# EAGLE design General IO (EAGLE 4.13)
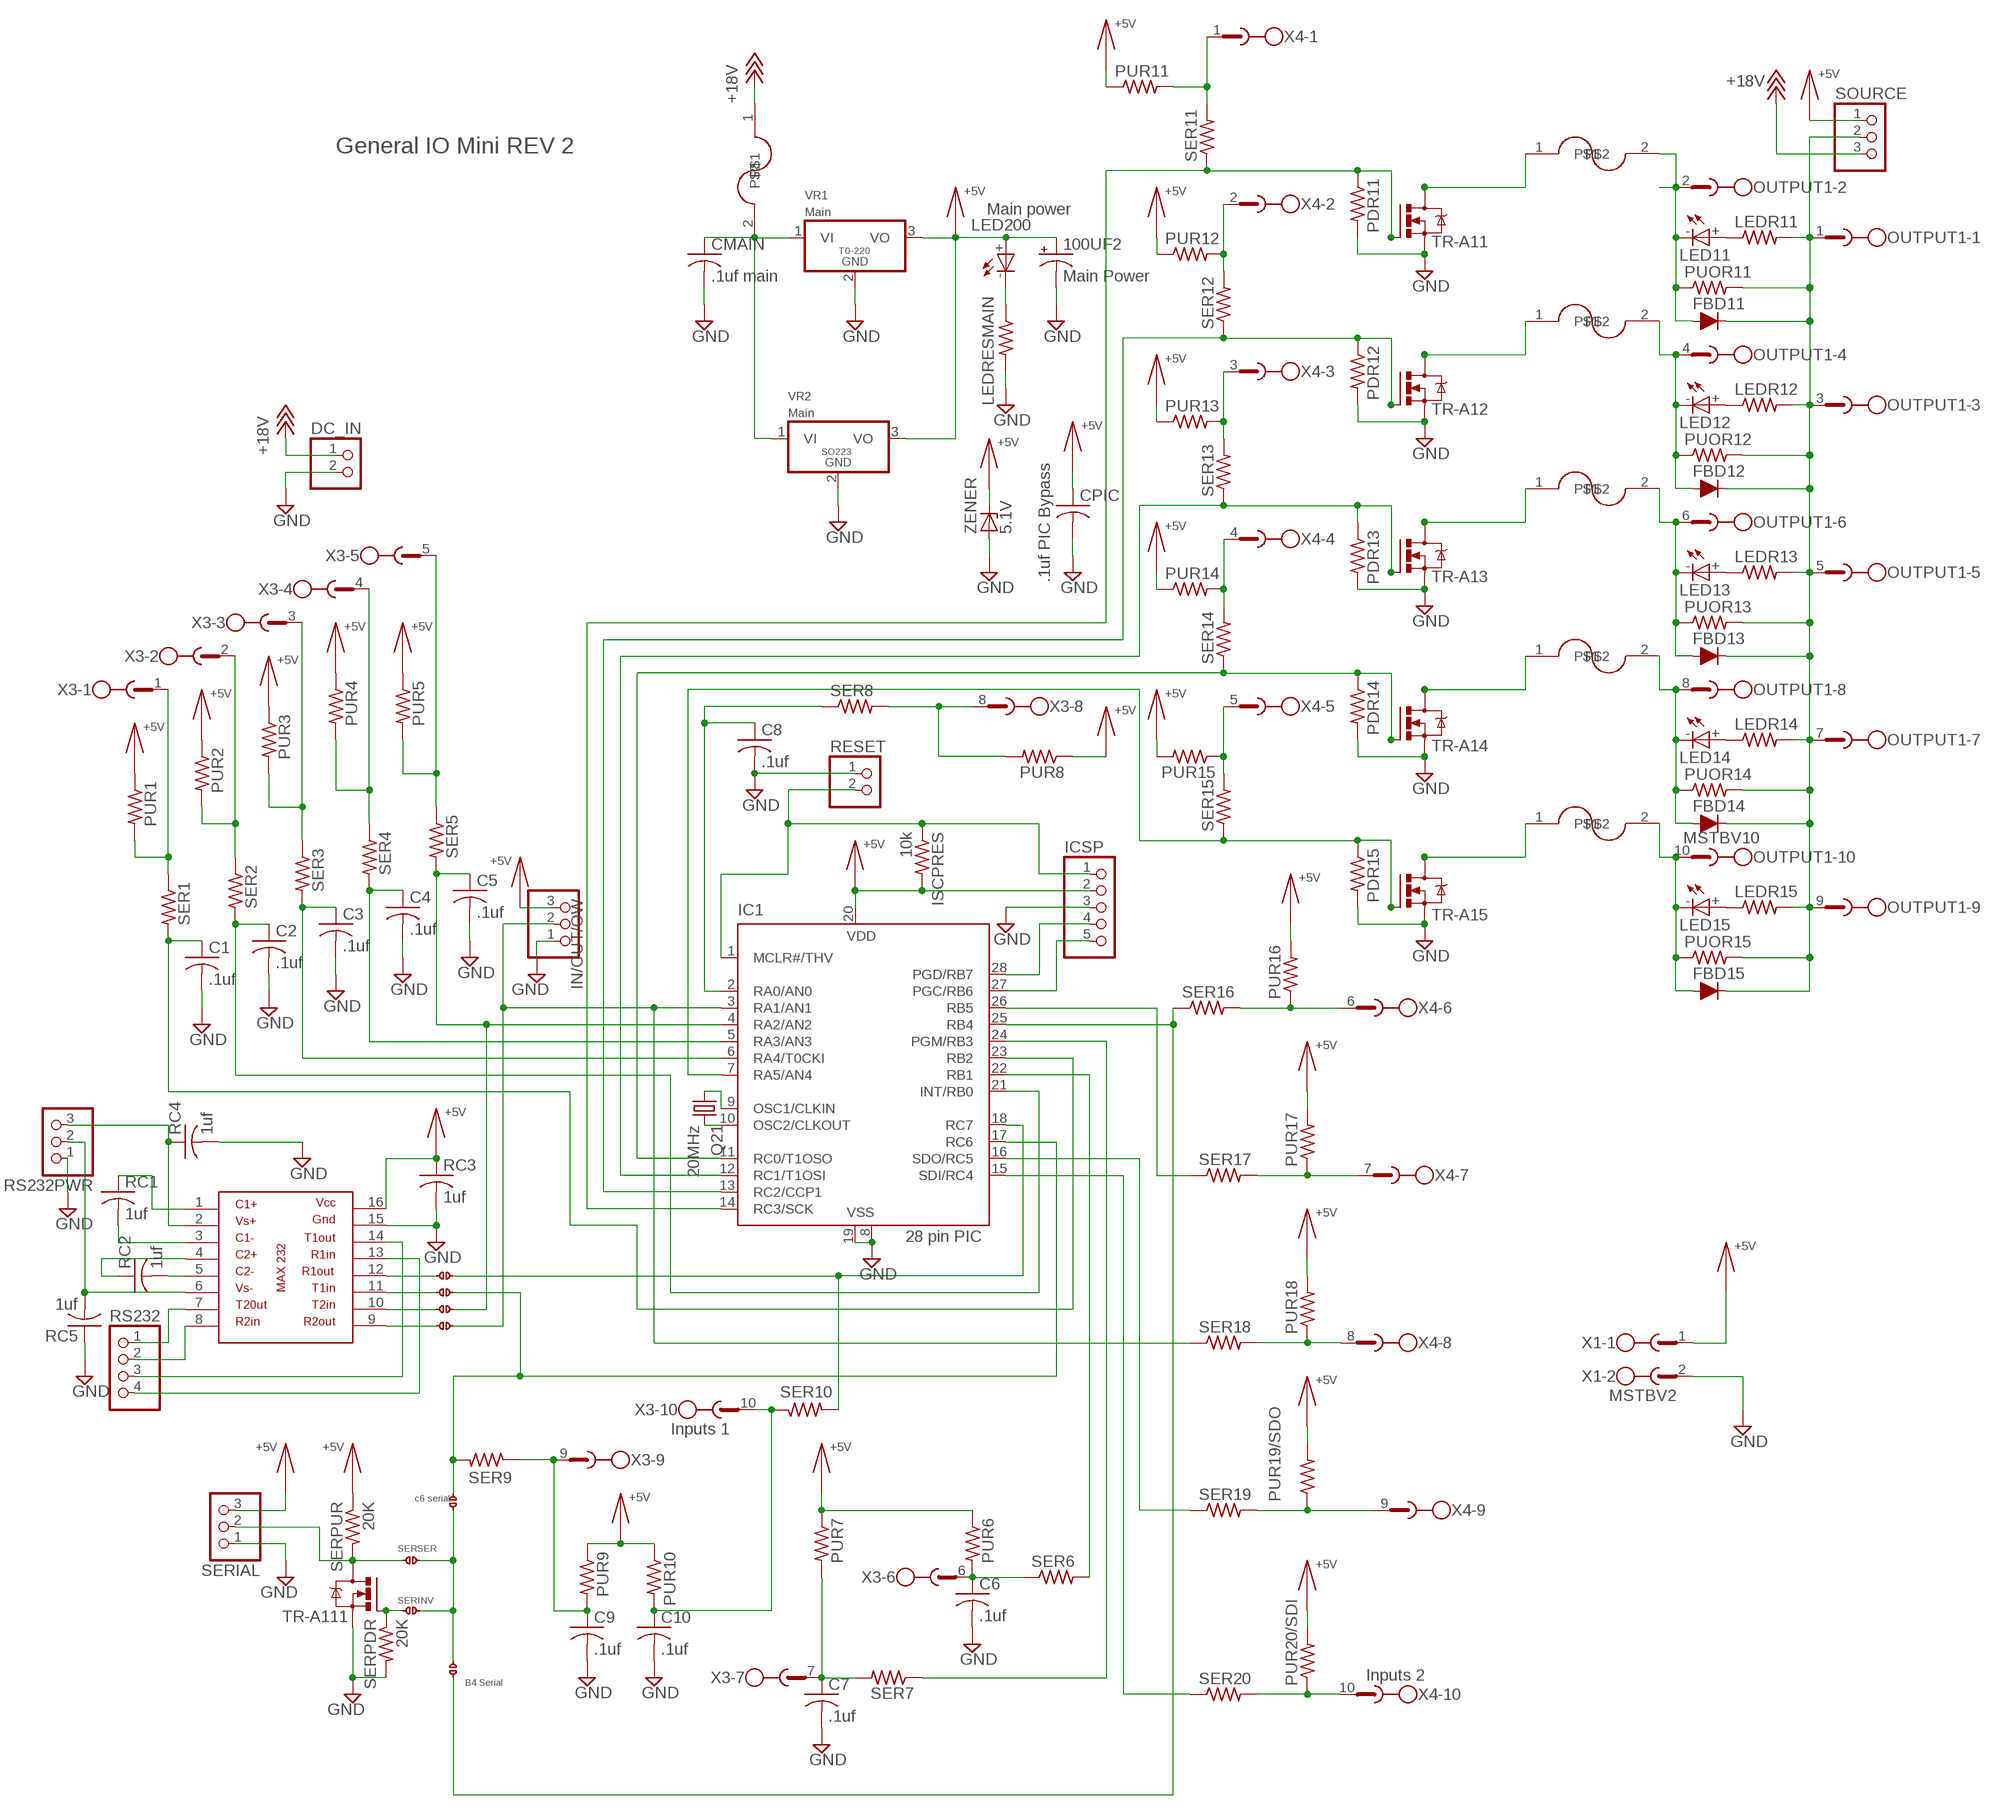
[diagram p0: schematic, sheet 1]

## Parts
100UF2  Main Power  CAPACITOR-ELECTROLYTICG  [PANASONIC_G]
B4SERIAL  SPLIT_PAD  [SPLIT_PAD]
C1  .1uf  CAPACITOR-NO-POLARITYC1210  [C1210]
C2  .1uf  CAPACITOR-NO-POLARITYC1210  [C1210]
C3  .1uf  CAPACITOR-NO-POLARITYC1210  [C1210]
C4  .1uf  CAPACITOR-NO-POLARITYC1210  [C1210]
C5  .1uf  CAPACITOR-NO-POLARITYC1210  [C1210]
C6  .1uf  CAPACITOR-NO-POLARITYC1210  [C1210]
C6SERIAL  SPLIT_PAD  [SPLIT_PAD]
C7  .1uf  CAPACITOR-NO-POLARITYC1210  [C1210]
C8  .1uf  CAPACITOR-NO-POLARITYC1210  [C1210]
C9  .1uf  CAPACITOR-NO-POLARITYC1210  [C1210]
C10  .1uf  CAPACITOR-NO-POLARITYC1210  [C1210]
CMAIN  .1uf main  CAPACITOR-NO-POLARITYC1210  [C1210]
CPIC  .1uf PIC Bypass  CAPACITOR-NO-POLARITYC1210  [C1210]
DC_IN  PINHD-1X2  [1X02]
FBD11  D-FILL-SOD-87  [SOD87]
FBD12  D-FILL-SOD-87  [SOD87]
FBD13  D-FILL-SOD-87  [SOD87]
FBD14  D-FILL-SOD-87  [SOD87]
FBD15  D-FILL-SOD-87  [SOD87]
IC1  28 pin PIC  PIC16F876SO  [SO-28W]
ICSP  PINHD-1X5  [1X05]
IN/OUT/OW  PINHD-1X3  [1X03]
ISCPRES  10k  RESISITORM1406  [M1406]
LED11  LED  [1206]
LED12  LED  [1206]
LED13  LED  [1206]
LED14  LED  [1206]
LED15  LED  [1206]
LED200  Main power  LED  [1206]
LEDR11  RESISITORM1406  [M1406]
LEDR12  RESISITORM1406  [M1406]
LEDR13  RESISITORM1406  [M1406]
LEDR14  RESISITORM1406  [M1406]
LEDR15  RESISITORM1406  [M1406]
LEDRESMAIN  RESISITORR1210  [R1210]
OUTPUT1  MSTBV10  [MSTBV10]
PDR11  RESISITORM1406  [M1406]
PDR12  RESISITORM1406  [M1406]
PDR13  RESISITORM1406  [M1406]
PDR14  RESISITORM1406  [M1406]
PDR15  RESISITORM1406  [M1406]
POLYFUSE11  POLYFUSE  [0204/5]
POLYFUSE12  POLYFUSE  [0204/5]
POLYFUSE13  POLYFUSE  [0204/5]
POLYFUSE14  POLYFUSE  [0204/5]
POLYFUSE15  POLYFUSE  [0204/5]
POLYFUSE200  Main power  POLYFUSE  [0204/5]
PUOR11  RESISITORM1406  [M1406]
PUOR12  RESISITORM1406  [M1406]
PUOR13  RESISITORM1406  [M1406]
PUOR14  RESISITORM1406  [M1406]
PUOR15  RESISITORM1406  [M1406]
PUR1  RESISITORM1406  [M1406]
PUR2  RESISITORM1406  [M1406]
PUR3  RESISITORM1406  [M1406]
PUR4  RESISITORM1406  [M1406]
PUR5  RESISITORM1406  [M1406]
PUR6  RESISITORM1406  [M1406]
PUR7  RESISITORM1406  [M1406]
PUR8  RESISITORM1406  [M1406]
PUR9  RESISITORM1406  [M1406]
PUR10  RESISITORM1406  [M1406]
PUR11  RESISITORM1406  [M1406]
PUR12  RESISITORM1406  [M1406]
PUR13  RESISITORM1406  [M1406]
PUR14  RESISITORM1406  [M1406]
PUR15  RESISITORM1406  [M1406]
PUR16  RESISITORM1406  [M1406]
PUR17  RESISITORM1406  [M1406]
PUR18  RESISITORM1406  [M1406]
PUR19/SDO  RESISITORM1406  [M1406]
PUR20/SDI  RESISITORM1406  [M1406]
Q21  20MHz  CRYSTALSM49  [SM49]
R1OUT  SPLIT_PAD  [SPLIT_PAD]
RC1  1uf  CAPACITOR-NO-POLARITYC1210  [C1210]
RC2  1uf  CAPACITOR-NO-POLARITYC1210  [C1210]
RC3  1uf  CAPACITOR-NO-POLARITYC1210  [C1210]
RC4  1uf  CAPACITOR-NO-POLARITYC1210  [C1210]
RC5  1uf  CAPACITOR-NO-POLARITYC1210  [C1210]
RESET  PINHD-1X2  [1X02]
RS232  PINHD-1X4  [1X04]
RS232PWR  PINHD-1X3  [1X03]
SER1  RESISITORM1406  [M1406]
SER2  RESISITORM1406  [M1406]
SER3  RESISITORM1406  [M1406]
SER4  RESISITORM1406  [M1406]
SER5  RESISITORM1406  [M1406]
SER6  RESISITORM1406  [M1406]
SER7  RESISITORM1406  [M1406]
SER8  RESISITORM1406  [M1406]
SER9  RESISITORM1406  [M1406]
SER10  RESISITORM1406  [M1406]
SER11  RESISITORM1406  [M1406]
SER12  RESISITORM1406  [M1406]
SER13  RESISITORM1406  [M1406]
SER14  RESISITORM1406  [M1406]
SER15  RESISITORM1406  [M1406]
SER16  RESISITORM1406  [M1406]
SER17  RESISITORM1406  [M1406]
SER18  RESISITORM1406  [M1406]
SER19  RESISITORM1406  [M1406]
SER20  RESISITORM1406  [M1406]
SERIAL  PINHD-1X3  [1X03]
SERIAL_INVERT  SPLIT_PAD  [SPLIT_PAD]
SERPDR  20K  RESISITORM1406  [M1406]
SERPUR  20K  RESISITORM1406  [M1406]
SERSER  SPLIT_PAD  [SPLIT_PAD]
SOURCE  PINHD-1X3  [1X03]
T1IN  SPLIT_PAD  [SPLIT_PAD]
T1IN1  SPLIT_PAD  [SPLIT_PAD]
T1IN2  SPLIT_PAD  [SPLIT_PAD]
TR-A11  ZXMN10A08GSOT223  [SOT223R_INFINEON]
TR-A12  ZXMN10A08GSOT223  [SOT223R_INFINEON]
TR-A13  ZXMN10A08GSOT223  [SOT223R_INFINEON]
TR-A14  ZXMN10A08GSOT223  [SOT223R_INFINEON]
TR-A15  ZXMN10A08GSOT223  [SOT223R_INFINEON]
TR-A111  ZXMN10A08GSOT223  [SOT223R_INFINEON]
U$1  MAX232  [SO16]
VR1  Main  VOLTAGE-REGULATOR  [TO220S]
VR2  Main  VOLTAGE-REGULATORSO-223  [SOT223R_INFINEON]
X1  MSTBV2  [MSTBV2]
X3  Inputs 1  MSTBV10  [MSTBV10]
X4  Inputs 2  MSTBV10  [MSTBV10]
ZENER  5.1V  ZENER-DIODESMB  [SMB]

## Nets
$N199: IC1.15(SDI/RC4) SER20.1
+5V: 100UF2.+ CPIC.1 IC1.20(VDD) ICSP.2 IN/OUT/OW.3 ISCPRES.2 LED200.+ PUR1.1 PUR2.1 PUR3.1 PUR4.1 PUR5.1 PUR6.1 PUR7.1 PUR8.1 PUR9.1 PUR10.1 PUR11.1 PUR12.1 PUR13.1 PUR14.1 PUR15.2 PUR16.2 PUR17.2 PUR18.2 PUR19/SDO.2 PUR20/SDI.2 RC3.1 SERIAL.3 SERPUR.1 SOURCE.1 U$1.16 VR1.3(VO) VR2.3(VO) X1.1 ZENER.C
+18V: DC_IN.1 POLYFUSE200.1 SOURCE.3
GND: 100UF2.- C1.2 C2.2 C3.2 C4.2 C5.2 C6.2 C7.2 C8.2 C9.2 C10.2 CMAIN.2 CPIC.2 DC_IN.2 IC1.8(VSS) IC1.19(VSS) ICSP.3 IN/OUT/OW.1 LEDRESMAIN.2 PDR11.2 PDR12.2 PDR13.2 PDR14.2 PDR15.2 RC3.2 RC4.2 RC5.1 RESET.1 RS232PWR.1 SERIAL.1 SERPDR.2 TR-A11.3(S) TR-A12.3(S) TR-A13.3(S) TR-A14.3(S) TR-A15.3(S) TR-A111.3(S) U$1.15 VR1.2(GND) VR2.2(GND) X1.2 ZENER.A
N$1: PUR20/SDI.1 SER20.2 X4.10
N$2: T1IN.P$2 U$1.11
N$3: PUR17.1 SER17.2 X4.7
N$4: R1OUT.P$2 U$1.12
N$5: T1IN1.P$2 U$1.10
N$6: T1IN2.P$2 U$1.9
N$7: C1.1 IC1.23(RB2) SER1.2
N$8: IC1.26(RB5) SER17.1
N$9: C2.1 IC1.21(INT/RB0) SER2.2
N$10: C3.1 IC1.6(RA4/T0CKI) SER3.2
N$11: IC1.16(SDO/RC5) SER19.1
N$12: C8.1 IC1.2(RA0/AN0) SER8.1
N$13: IC1.13(RC2/CCP1) PDR12.1 SER12.1 TR-A12.1(G)
N$14: IC1.12(RC1/T1OSI) PDR13.1 SER13.1 TR-A13.1(G)
N$15: IC1.11(RC0/T1OSO) PDR14.1 SER14.1 TR-A14.1(G)
N$16: FBD12.2(A) LED12.- OUTPUT1.4 POLYFUSE12.2 PUOR12.1
N$17: POLYFUSE15.1 TR-A15.2(D)
N$18: FBD15.2(A) LED15.- OUTPUT1.10 POLYFUSE15.2 PUOR15.1
N$19: RS232.1 U$1.7
N$20: PUR16.1 SER16.2 X4.6
N$21: POLYFUSE14.1 TR-A14.2(D)
N$22: FBD14.2(A) LED14.- OUTPUT1.8 POLYFUSE14.2 PUOR14.1
N$23: POLYFUSE13.1 TR-A13.2(D)
N$24: FBD13.2(A) LED13.- OUTPUT1.6 POLYFUSE13.2 PUOR13.1
N$25: PUR14.2 SER14.2 X4.4
N$26: PUR12.2 SER12.2 X4.2
N$27: POLYFUSE12.1 TR-A12.2(D)
N$28: PUR13.2 SER13.2 X4.3
N$29: POLYFUSE11.1 TR-A11.2(D)
N$30: FBD11.2(A) LED11.- OUTPUT1.2 POLYFUSE11.2 PUOR11.1
N$31: IC1.28(PGD/RB7) ICSP.4
N$32: PUR15.1 SER15.2 X4.5
N$33: IC1.7(RA5/AN4) PDR15.1 SER15.1 TR-A15.1(G)
N$35: IC1.10(OSC2/CLKOUT) Q21.2
N$36: SERIAL_INVERT.P$2 SERPDR.1 TR-A111.1(G)
N$37: IC1.1(MCLR#/THV) ICSP.1 ISCPRES.1 RESET.2
N$38: SERIAL.2 SERPUR.2 SERSER.P$2 TR-A111.2(D)
N$39: IC1.9(OSC1/CLKIN) Q21.1
N$40: IC1.27(PGC/RB6) ICSP.5
N$41: IC1.18(RC7) R1OUT.P$1 SER10.2
N$42: C9.1 PUR9.2 SER9.1 X3.9
N$43: C5.1 IC1.4(RA2/AN2) SER5.2 T1IN1.P$1
N$44: C6SERIAL.P$1 IC1.17(RC6) SER9.2 T1IN.P$1
N$45: RS232.2 U$1.8
N$49: RS232.3 U$1.14
N$52: FBD11.1(C) FBD12.1(C) FBD13.1(C) FBD14.1(C) FBD15.1(C) LEDR11.2 LEDR12.2 LEDR13.2 LEDR14.2 LEDR15.2 OUTPUT1.1 OUTPUT1.3 OUTPUT1.5 OUTPUT1.7 OUTPUT1.9 PUOR11.2 PUOR12.2 PUOR13.2 PUOR14.2 PUOR15.2 SOURCE.2
N$55: LED200.- LEDRESMAIN.1
N$60: RS232.4 U$1.13
N$63: CMAIN.1 POLYFUSE200.2 VR1.1(VI) VR2.1(VI)
N$71: LED15.+ LEDR15.1
N$72: LED14.+ LEDR14.1
N$73: LED13.+ LEDR13.1
N$74: LED12.+ LEDR12.1
N$75: LED11.+ LEDR11.1
N$77: PUR3.2 SER3.1 X3.3
N$80: RC2.2 U$1.5
N$81: RC1.2 U$1.3
N$82: RC2.1 U$1.4
N$83: RC1.1 U$1.1
N$84: RC4.1 RS232PWR.3 U$1.2
N$85: RC5.2 RS232PWR.2 U$1.6
N$86: PUR4.2 SER4.1 X3.4
N$87: PUR5.2 SER5.1 X3.5
N$88: PUR8.2 SER8.2 X3.8
N$89: PUR1.2 SER1.1 X3.1
N$90: IC1.14(RC3/SCK) PDR11.1 SER11.1 TR-A11.1(G)
N$91: PUR2.2 SER2.1 X3.2
N$92: PUR11.2 SER11.2 X4.1
N$95: C4.1 IC1.5(RA3/AN3) SER4.2
N$99: B4SERIAL.P$2 IC1.25(RB4) SER16.1
N$100: PUR19/SDO.1 SER19.2 X4.9
N$102: PUR18.1 SER18.2 X4.8
N$104: B4SERIAL.P$1 C6SERIAL.P$2 SERIAL_INVERT.P$1 SERSER.P$1
N$106: C6.1 PUR6.2 SER6.1 X3.6
N$107: IC1.22(RB1) SER6.2
N$108: C7.1 PUR7.2 SER7.2 X3.7
N$109: C10.1 PUR10.2 SER10.1 X3.10
N$111: IC1.24(PGM/RB3) SER7.1
SER18: IC1.3(RA1/AN1) IN/OUT/OW.2 SER18.1 T1IN2.P$1

## Notes on the sheet
- General IO Mini REV 2
- T0-220
- SO223
- c6 serial
- SERSER
- SERINV
- B4 Serial

## Library data of the parts
100UF2 = 1 Dan's Common Parts:CAPACITOR-ELECTROLYTIC: POLARIZED CAPACITOR, American symbol
B4SERIAL C6SERIAL R1OUT SERIAL_INVERT SERSER T1IN T1IN1 T1IN2 = 1 Dan's Common Parts:SPLIT_PAD
C1-C10 CMAIN CPIC RC1-RC5 = 1 Dan's Common Parts:CAPACITOR-NO-POLARITY: CAPACITOR, American symbol
DC_IN RESET = pinhead:PINHD-1X2: PIN HEADER
FBD11-FBD15 = semicon-smd-ipc:D-FILL-: DIODE filled
IC1 = 1 Dan's Common Parts:PIC16*876: MICROCONTROLLER flash type
ICSP = pinhead:PINHD-1X5: PIN HEADER
IN/OUT/OW RS232PWR SERIAL SOURCE = pinhead:PINHD-1X3: PIN HEADER
ISCPRES LEDR11-LEDR15 LEDRESMAIN PDR11-PDR15 PUOR11-PUOR15 PUR1-PUR18 PUR19/SDO PUR20/SDI SER1-SER20 SERPDR SERPUR = 1 Dan's Common Parts:RESISITOR: RESISTOR, American symbol
LED11-LED15 LED200 = 1 Dan's Common Parts:LED
OUTPUT1 X3 X4 = con-phoenix-508:MSTBV10: PHOENIX
POLYFUSE11-POLYFUSE15 POLYFUSE200 = 1 Dan's Common Parts:POLYFUSE
Q21 = 1 Dan's Common Parts:CRYSTAL: CRYSTAL
RS232 = pinhead:PINHD-1X4: PIN HEADER
TR-A11-TR-A15 TR-A111 = 1 Dan's Common Parts:ZXMN10A08G: N-CHANNEL MOS FET
U$1 = 1 Dan's Common Parts:MAX232
VR1 VR2 = 1 Dan's Common Parts:VOLTAGE-REGULATOR: Positive VOLTAGE REGULATOR Source: http://cache.national.com/ds/LM/LM78L05.pdf http://www.fairchildsemi.com/ds/LM/LM7805.pdf
X1 = con-phoenix-508:MSTBV2: PHOENIX
ZENER = 1 Dan's Common Parts:ZENER-DIODE: Z-Diode

## Board
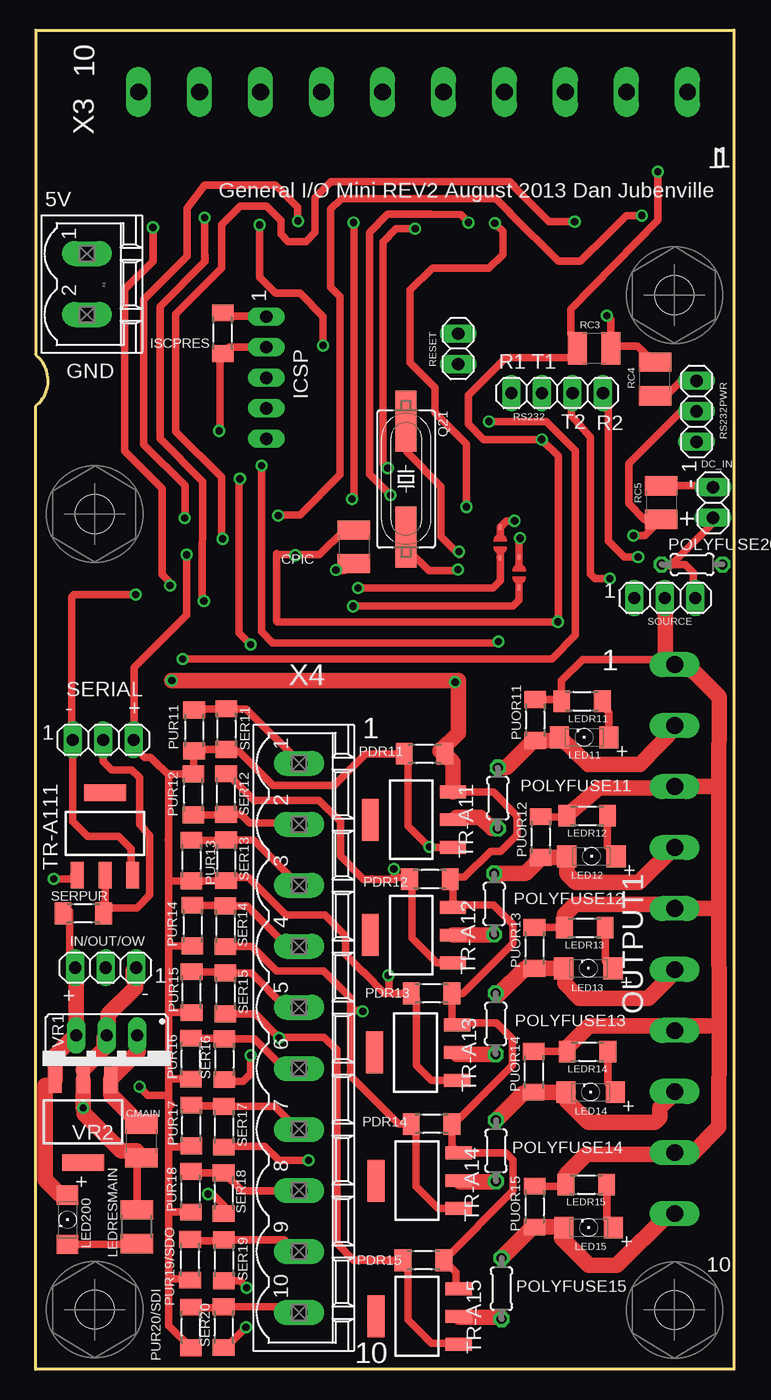
[diagram p1: board, top side]
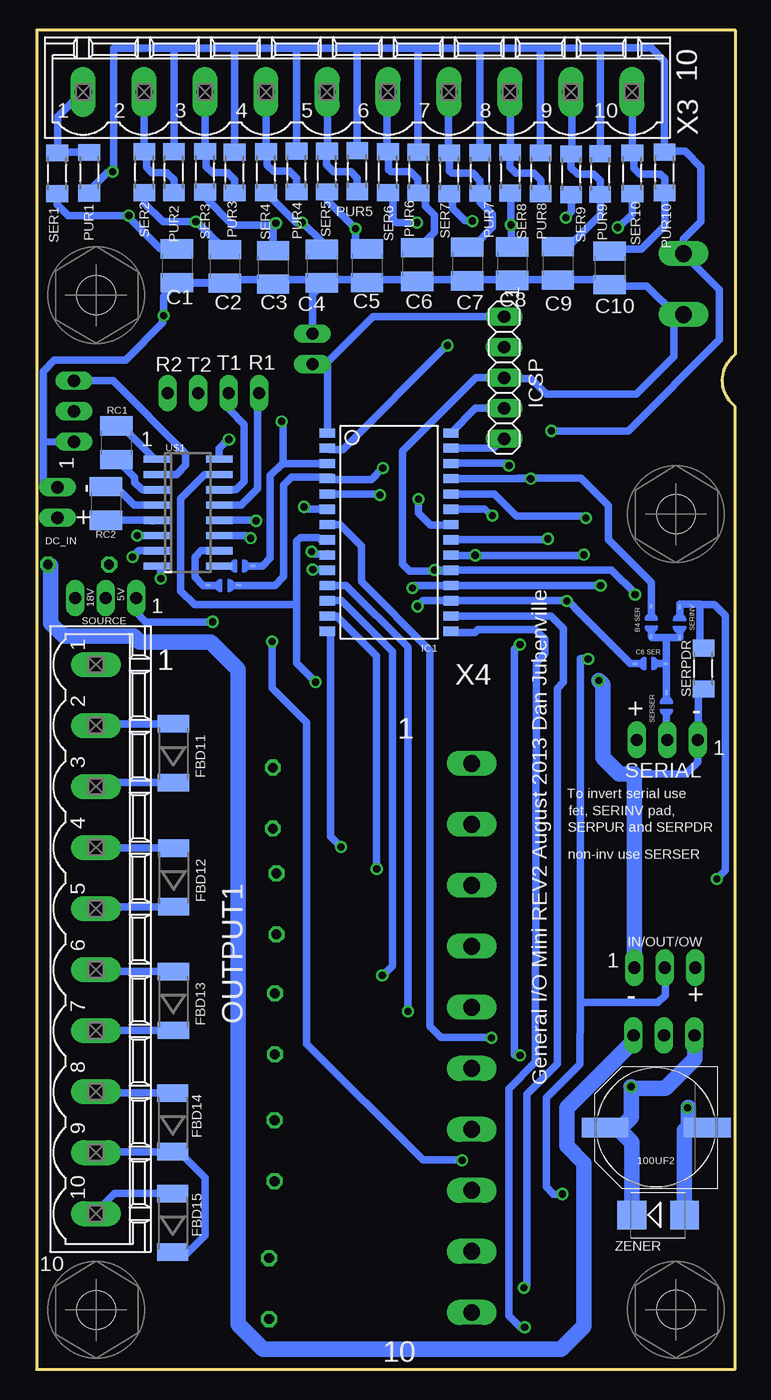
[diagram p2: board, bottom side, seen from below]

Size 58.17 x 111.53 mm. Coordinates in mm from the lower left corner, seen from the top.
Outline: 0.1,80.29 arc100 0.08,84.43
Outline: 0,84.51 0,111.53 58.17,111.53 58.17,0 0,0 0,80.19
Copper layers (1*16): Top 0.035mm / dielectric 1.5mm / Bottom 0.035mm
Design rules "default": minimum track width 5mil, minimum drill 20mil, track to track 15mil, track to pad 15mil, pad to pad 15mil, via to via 15mil, smd to smd 0mil, copper to edge 5mil, drill to drill 5mil, minimum pad ring 10mil, minimum via ring 8mil, stop-mask expansion 4mil, vias tented up to drill 0mil, thermal gap 10mil

### Footprints (pad centres in the part's own frame; a part is rotated, then mirrored left to right if it is on the bottom)
PANASONIC_G = smd 3.9 x 1.6: + 4.25,0; - -4.25,0
SPLIT_PAD = smd 0.406 x 0.203: P$1 0,0; P$2 2.54,0
C1210 = smd 1.6 x 2.7: 1 -1.4,0; 2 1.4,0
1X02 = drill 1.016 long: 1 -1.27,0; 2 1.27,0
SOD87 = smd 1.45 x 2.6: 1 -2.445,0; 2 2.445,0
SO-28W = smd 0.762 x 1.27: 1 -7.62,-5.207; 2 -6.35,-5.207; 3 -5.08,-5.207; 4 -3.81,-5.207; 5 -2.54,-5.207; 6 -1.27,-5.207; 7 0,-5.207; 8 1.27,-5.207; 9 2.54,-5.207; 10 3.81,-5.207; 11 5.08,-5.207; 12 6.35,-5.207; 13 7.62,-5.207; 14 8.89,-5.207; 15 8.89,5.08; 16 7.62,5.08; 17 6.35,5.08; 18 5.08,5.08; 19 3.81,5.08; 20 2.54,5.08; 21 1.27,5.08; 22 0,5.08; 23 -1.27,5.08; 24 -2.54,5.08; 25 -3.81,5.08; 26 -5.08,5.08; 27 -6.35,5.08; 28 -7.62,5.08
1X05 = drill 1.016 long: 1 -5.08,0; 2 -2.54,0; 3 0,0; 4 2.54,0; 5 5.08,0
1X03 = drill 1.016 long: 1 -2.54,0; 2 0,0; 3 2.54,0
M1406 = smd 1.4 x 1.8: 1 -1.7,0; 2 1.7,0
1206 = smd 1.6 x 1.803: + -1.422,0; - 2.692,0
R1210 = smd 1.6 x 2.7: 1 -1.4,0; 2 1.4,0
MSTBV10 = drill 1.397 long: 1 -22.86,0; 2 -17.78,0; 3 -12.7,0; 4 -7.62,0; 5 -2.54,0; 6 2.54,0; 7 7.62,0; 8 12.7,0; 9 17.78,0; 10 22.86,0
0204/5 = drill 0.813 octagon: 1 -2.54,0; 2 2.54,0
SM49 = smd 5.08 x 1.778: 1 -4.826,0; 2 4.826,0
1X04 = drill 1.016 long: 1 -3.81,0; 2 -1.27,0; 3 1.27,0; 4 3.81,0
SOT223R_INFINEON = smd 1.067 x 2.184: 1 -2.311,-3.479; 2 0,-3.48; 3 2.312,-3.48 | smd 3.5 x 1.4: 4 0,3.404
SO16 = smd 0.6 x 2.2: 1 -4.445,-2.6; 2 -3.175,-2.6; 3 -1.905,-2.6; 4 -0.635,-2.6; 5 0.635,-2.6; 6 1.905,-2.6; 7 3.175,-2.6; 8 4.445,-2.6; 9 4.445,2.6; 10 3.175,2.6; 11 1.905,2.6; 12 0.635,2.6; 13 -0.635,2.6; 14 -1.905,2.6; 15 -3.175,2.6; 16 -4.445,2.6
SCREW = hole 3.2: 0,0
TO220S = drill 1.016 long: 1 -2.54,-2.54; 2 0,-2.54; 3 2.54,-2.54
MSTBV2 = drill 1.397 long: 1 -2.54,0; 2 2.54,0
SMB = smd 2.4 x 2.4: A 2.2,0; C -2.2,0

### Placement (x,y rotation side)
100UF2  6.58,20.14 180 bottom
B4SERIAL  6.99,61.01 90 bottom
C1  46.48,91.9 270 bottom
C2  42.49,91.85 270 bottom
C3  38.48,91.77 270 bottom
C4  34.42,91.87 270 bottom
C5  30.66,91.9 270 bottom
C6  26.47,92 270 bottom
C6SERIAL  8.33,58.78 0 bottom
C7  22.3,92.05 270 bottom
C8  18.57,92.08 270 bottom
C9  14.76,92.1 270 bottom
C10  10.44,91.72 270 bottom
CMAIN  8.81,19.02 270 top
CPIC  26.52,68.5 270 top
DC_IN  56.44,72.19 90 top
FBD11  46.79,51.31 90 bottom
FBD12  46.76,40.97 90 bottom
FBD13  46.79,30.68 90 bottom
FBD14  46.84,20.57 90 bottom
FBD15  46.84,12.22 90 bottom
IC1  28.75,70.36 270 bottom
ICSP  19.23,82.58 270 bottom
IN/OUT/OW  5.84,33.45 180 top
ISCPRES  15.6,86.28 270 top
LED11  46.33,52.63 180 top
LED12  46.94,42.72 180 top
LED13  46.69,33.4 180 top
LED14  46.86,23.09 180 top
LED15  46.71,11.81 180 top
LED200  2.67,13.11 270 top
LEDR11  45.52,55.65 180 top
LEDR12  45.95,46.1 180 top
LEDR13  45.75,36.78 180 top
LEDR14  45.97,26.47 180 top
LEDR15  45.87,15.39 180 top
LEDRESMAIN  8.46,11.89 90 top
OUTPUT1  53.24,35.84 270 bottom
PDR11  32.41,51.26 0 top
PDR12  32.84,40.82 0 top
PDR13  32.99,31.32 0 top
PDR14  32.99,20.45 0 top
PDR15  32.31,9.09 0 top
POLYFUSE11  38.51,47.57 90 top
POLYFUSE12  38.2,38.76 90 top
POLYFUSE13  38.33,28.78 90 top
POLYFUSE14  38.35,18.21 90 top
POLYFUSE15  38.81,6.73 90 top
POLYFUSE200  54.69,67.03 0 top
PUOR11  41.61,54.08 90 top
PUOR12  42.06,44.32 90 top
PUOR13  41.55,35.1 90 top
PUOR14  41.5,24.79 90 top
PUOR15  41.58,13.56 90 top
PUR1  53.8,99.64 90 bottom
PUR2  46.74,99.7 270 bottom
PUR3  41.68,99.67 270 bottom
PUR4  36.53,99.75 270 bottom
PUR5  31.47,99.77 270 bottom
PUR6  26.37,99.67 270 bottom
PUR7  21.23,99.62 270 bottom
PUR8  16.21,99.59 270 bottom
PUR9  11.23,99.54 270 bottom
PUR10  5.87,99.67 270 bottom
PUR11  13.21,53.21 90 top
PUR12  13.16,47.88 270 top
PUR13  12.98,42.37 90 top
PUR14  13.08,36.96 90 top
PUR15  13,31.42 270 top
PUR16  12.95,25.88 270 top
PUR17  12.98,20.32 270 top
PUR18  12.93,14.81 270 top
PUR19/SDO  12.88,9.14 270 top
PUR20/SDI  12.95,3.51 270 top
Q21  30.86,74.14 270 top
R1OUT  38.71,67.59 90 top
RC1  51.54,77.17 270 bottom
RC2  52.4,72.11 270 bottom
RC3  46.53,85.04 0 top
RC4  51.59,82.47 90 top
RC5  52.12,72.19 270 top
RESET  35.2,84.99 270 top
RS232  43.46,81.31 180 top
RS232PWR  55.07,79.78 90 top
SER1  56.46,99.59 270 bottom
SER2  49.2,99.7 270 bottom
SER3  44.15,99.72 270 bottom
SER4  39.07,99.7 270 bottom
SER5  33.99,99.75 270 bottom
SER6  28.91,99.7 270 bottom
SER7  23.83,99.59 90 bottom
SER8  18.75,99.64 90 bottom
SER9  13.64,99.52 270 bottom
SER10  8.56,99.59 270 bottom
SER11  15.9,53.31 90 top
SER12  15.87,47.9 270 top
SER13  15.87,42.39 90 top
SER14  15.82,36.91 90 top
SER15  15.82,31.32 90 top
SER16  15.72,25.83 90 top
SER17  15.7,20.22 90 top
SER18  15.67,14.68 90 top
SER19  15.7,9.09 90 top
SER20  15.67,3.53 90 top
SERIAL  5.64,52.43 0 top
SERIAL_INVERT  4.62,60.96 90 bottom
SERPDR  2.64,58.37 270 bottom
SERPUR  3.99,37.97 0 top
SERSER  5.71,56.36 270 bottom
SOURCE  52.43,64.24 0 top
T1IN  40.28,65.1 90 top
T1IN1  41.35,65.28 180 bottom
T1IN2  40.13,66.9 180 bottom
TR-A11  31.29,45.77 90 top
TR-A12  31.29,36.17 90 top
TR-A13  31.65,26.39 90 top
TR-A14  31.78,15.72 90 top
TR-A15  31.78,4.42 90 top
TR-A111  5.79,44.63 0 top
U$1  45.57,71.35 270 bottom
U$11  [SCREW]  4.93,4.98 0 top
U$13  [SCREW]  4.93,71.22 0 top
U$14  [SCREW]  53.21,4.95 0 top
U$15  [SCREW]  53.21,89.46 0 top
VR1  5.92,25.27 180 top
VR2  3.96,20.62 180 top
X1  4.29,90.37 270 top
X3  31.45,106.38 0 bottom
X4  21.95,27.61 270 top
ZENER  6.41,12.86 0 bottom

### Tracks (layer width: path | path; a pad name or v marks a point on that pad's centre or on a via)
$N199  (via drill 0.6)
  Top 0.61: 15.75,1.88 15.7,1.83 SER20.1 15.7,1.8 15.7,1.68 | 15.7,1.68 v17.53,3.5 | 15.7,1.68 15.7,1.6
  Bottom 0.61: v17.53,3.5 17.53,3.61 | 23.8,61.47 23.83,61.49 | 23.8,61.47 IC1.15 | 23.8,61.47 23.7,61.37 21.67,61.37 21.41,61.62 16.66,61.62 15.85,60.81 15.85,59.56 16.56,58.85 16.61,25.6 18.85,23.37 18.85,4.47 17.88,3.5 v17.53,3.5 | 17.6,3.48 17.58,3.5 v17.53,3.5
+5V  (via drill 0.6)
  Top 0.61: CPIC.1 25.73,69.9 23.67,67.84 21.69,67.84 v21.64,67.79 21.64,67.84 20.17,67.84 20.09,67.92 20.09,62.33 20.17,62.25 v43.51,62.25 43.54,62.25 43.54,76.05 42.14,77.45 | SERPUR.1 2.67,38.2 2.84,38.15 2.84,33.78 3.23,33.4 | 3.23,33.4 3.28,33.45 IN/OUT/OW.3 | v51.84,99.75 51.84,95.68 44.59,88.3 44.59,86.19 45.13,85.68 RC3.1 45.24,85.04 | SERIAL.3 8.23,52.43 8.2,54.43 | 8.2,54.43 8.2,51.92 9.09,50.98 9.6,50.98 11.2,49.38 11.1,49.38 | 11.1,5.71 11.1,7.54 | 11.1,7.54 11.1,10.82 | 11.1,5.71 11.1,5.54 | 11.1,10.82 11.1,13.13 | 11.1,13.13 11.1,16.61 | 11.1,16.61 11.1,18.54 | 11.1,18.54 11.1,21.87 | 11.1,22.84 11.1,22.05 11.13,22.02 | 11.1,22.84 11.1,24.16 | 11.1,24.16 11.1,27.74 | 11.1,27.74 11.1,29.72 | 11.1,29.72 11.1,33.15 | 11.1,33.15 11.1,35.31 | 11.1,35.31 11.1,40.72 | 11.1,40.72 11.1,44.09 | 11.1,44.09 11.1,49.38 | 11.1,49.38 11.1,49.61 | 11.1,10.82 11.12,10.82 11.13,10.82 | 11.1,16.61 11.2,16.51 | 11.1,44.09 11.05,44.09 11.08,44.07 | 11.1,33.15 11.12,33.15 11.15,33.12 | 11.1,27.74 11.12,27.74 | 3.4,27.79 VR1.3 3.3,27.81 | 3.4,33.22 3.23,33.4 | 1.57,23.65 1.65,23.93 VR2.3 | 2.06,14.55 2.67,14.5 LED200.+ | 11.1,21.87 11.1,22.84 | 11.1,21.87 11.28,22.05 | 11.1,22.84 9.35,22.84 v8.66,23.55 | 45.24,85.04 45.29,85.09 | 39.27,84.25 44.45,84.25 45.24,85.04 | 39.27,84.25 39.17,84.25 36.04,81.13 36.04,78.72 37.31,77.45 42.14,77.45 | 39.27,84.25 39.27,84.23 39.29,84.25 | PUR20/SDI.2 11.1,3.66 11.1,5.71 | PUR19/SDO.2 12.78,7.54 11.1,7.54 | PUR18.2 12.9,13.13 11.1,13.13 | PUR17.2 12.9,18.54 11.1,18.54 | PUR16.2 11.13,24.18 11.1,24.16 | PUR15.2 11.1,29.72 | 11.1,35.31 11.12,35.31 11.17,35.26 PUR14.1 | 11.1,40.72 11.2,40.72 11.25,40.67 PUR13.1
  Top 0.61: 11.1,49.61 11.07,49.63 | 11.1,49.61 11.13,49.58 PUR12.1 13.16,51.66 13.18,51.69 13.21,51.66 PUR11.1 | ICSP.2 16.13,85.12 ISCPRES.2 15.5,84.68 15.39,84.68 15.39,78.26 v15.29,78.16 | 8.2,54.43 8.2,58.45 12.57,62.81 12.57,67.84 v12.6,67.84 | 42.14,77.45 v42.16,77.45
  Top 1.27: 3.4,27.79 3.4,33.22 | VR2.3 1.65,26.16 3.3,27.81 | 1.57,23.65 0.81,23.65 0.81,15.8 2.06,14.55
  Bottom 0.61: 41.68,110.01 36.58,110.01 36.52,110.01 | 46.71,110.01 41.68,110.01 | 46.71,110.01 51.74,110.01 51.74,99.77 | 36.52,110.01 31.5,110.03 | 31.5,110.03 26.39,110.03 | 26.39,110.03 21.23,110.03 | 21.23,110.03 16.23,110.03 | 16.23,110.03 11.23,110.06 | 11.23,110.06 7.04,110.06 7.04,110.08 5.89,108.94 5.89,101.34 PUR10.1 6.02,101.37 6.04,101.4 5.99,101.45 4.17,101.45 2.84,100.13 2.84,95.56 4.29,94.11 X1.1 1.29,89.92 1.29,85.75 8.89,78.16 v15.29,78.16 | 51.74,99.77 51.89,99.92 | PUR6.1 26.39,101.34 26.39,110.03 | 21.23,110.03 PUR7.1 | PUR8.1 16.23,101.27 16.23,110.03 | 11.23,101.12 PUR9.1 11.23,110.06 | IC1.20 23.65,67.82 23.62,67.79 v21.64,67.79 12.6,67.79 v12.6,67.84 | 51.74,99.77 51.84,99.67 v51.84,99.75 | 8.56,23.44 8.71,23.44 | 3.35,27.71 3.38,27.74 VR1.3 | 11.54,20.33 11.63,20.4 | 11.54,20.33 100UF2.+ 9.47,20.14 9.42,20.19 | 11.54,20.33 11.46,20.32 | 8.56,23.44 8.56,23.42 | v8.66,23.55 8.56,23.62 8.56,23.44 | SOURCE.1 49.94,64.29 49.91,63.09 49.07,62.25 v43.51,62.25 | 42.16,77.5 42.14,77.52 | v42.16,77.45 42.16,77.5 | U$1.16 42.97,76.69 42.16,77.5 | v51.84,99.75 51.82,99.72 | v51.84,99.75 51.84,99.64 52.3,99.64 53.92,98.02 53.85,97.94 PUR1.1 | ICSP.2 19.28,85.12 | 31.5,110.03 31.5,109.98 31.47,109.96 PUR5.1 | 36.52,110.01 PUR4.1 | 41.68,110.01 PUR3.1 | 46.71,110.01 46.71,109.98 46.74,109.96 PUR2.1
  Bottom 1.27: 3.35,27.71 3.35,25.88 5.82,23.42 8.53,23.42 8.56,23.44 | ZENER.C 8.61,18.9 9.98,20.27 11.46,20.32 | v8.66,23.55 8.64,23.55 8.64,20.98 9.42,20.19
+18V
  Top 0.61: DC_IN.1 56.44,70.71 56.54,70.61 52.88,66.95 52.17,66.95 52.17,67.01 POLYFUSE200.1 52.15,67.01 54.13,67.01 54.79,66.34 54.79,64.41 SOURCE.3
GND  (via drill 0.6)
  Top 0.61: 8.1,41.07 8.15,41.02 | 8.1,41.07 TR-A111.3 | 8.1,41.07 7.95,41.22 7.95,43.36 6.93,44.37 4.34,44.37 3.1,45.62 SERIAL.1 3.1,52.32 3.07,52.3 3.02,52.35 3.02,64.34 3.2,64.52 v8.33,64.52 | 27.18,67.56 26.72,67.1 CPIC.2 26.52,67.08 26.04,66.6 25.65,66.52 24.89,66.52 v25.02,66.57 | TR-A15.3 35.15,6.63 35,6.63 35,8.1 PDR15.2 39.78,14.86 39.78,17.45 39.19,18.03 TR-A14.3 | TR-A14.3 35.13,18.03 | TR-A14.3 34.67,18.62 34.67,20.45 PDR14.2 34.85,20.45 39.73,25.32 39.73,27.53 38.4,28.85 35.28,28.85 TR-A13.3 | TR-A13.3 34.92,28.5 | TR-A13.3 35.05,28.7 34.7,29.06 PDR13.2 35.61,31.32 39.78,35.48 39.78,37.06 38.15,38.68 34.95,38.68 34.75,38.48 | 34.75,38.48 34.67,38.4 | 34.75,38.48 TR-A12.3 34.77,40.51 34.47,40.82 | 34.47,40.82 34.44,40.84 | 34.47,40.82 PDR12.2 34.72,41 35.74,41 37.9,43.15 38.73,43.15 40.11,44.53 40.11,46.1 38.12,48.08 TR-A11.3 | 34.06,51.26 PDR11.2 34.09,51.26 34.01,51.18 33.71,51.49 | 8.15,33.22 IN/OUT/OW.1 | 8.33,32.36 8.15,32.54 | 6.07,27.86 5.97,27.86 VR1.2 5.92,27.84 | VR2.2 3.96,24.94 | 5.92,27.84 5.97,27.89 | 5.74,27.66 5.92,27.84 | LEDRESMAIN.2 8.46,17.55 8.64,17.73 8.74,17.62 CMAIN.2 8.89,17.62 8.94,17.68 8.41,18.21 | v3.96,21.79 3.79,21.62 4.06,21.29 | 34.9,57.38 34.9,57.23 v34.95,57.23 | DC_IN.2 56.44,73.48 56.33,73.59 RC5.1 56.38,73.59 56.44,73.53 | RC4.2 50.14,85.22 47.95,85.22 47.93,85.2 RC3.2 47.93,87.42 v47.6,87.76
  Top 1.27: TR-A11.3 34.77,50.55 34.06,51.26 | 33.71,51.49 35.23,53.01 35.23,57.38 34.9,57.38 v11.35,57.38 | 8.15,32.54 8.15,33.22 | 8.33,32.36 8.33,31.83 6.07,29.57 6.07,27.86 | 3.96,24.94 5.74,26.72 5.74,27.66 | v3.96,21.79 VR2.2 | 4.06,21.29 7.14,18.21 8.41,18.21
  Bottom 0.61: 38.71,90.75 41.93,90.75 | 41.93,90.75 42.16,90.75 | 33.78,90.75 38.71,90.75 | 30.07,90.75 33.78,90.75 | 26.11,90.75 30.07,90.75 | 22.25,90.75 26.11,90.75 | 17.93,90.75 22.25,90.75 | 14.25,90.75 14.68,90.75 | 14.68,90.75 17.93,90.75 | 14.25,90.75 10.85,90.75 10.95,90.65 | C3.2 38.71,90.6 38.71,90.75 | 33.78,90.75 33.78,90.58 34.31,90.58 C4.2 34.42,90.32 35.2,89.51 RESET.1 | 30.07,90.75 30.07,90.48 30.64,90.48 C5.2 30.81,90.65 30.81,90.7 | 26.11,90.75 26.11,90.53 26.39,90.53 C6.2 | 22.25,90.75 22.25,90.6 | 22.25,90.6 22.25,90.58 | 17.93,90.75 17.93,90.48 18.37,90.48 C8.2 | 14.25,90.75 14.25,90.58 14.63,90.58 C9.2 14.73,90.7 14.68,90.75 | 10.95,90.65 11.63,90.65 | 23.57,66.6 23.62,66.55 23.65,66.55 | 46.76,90.45 C2.2 | 46.76,90.45 46.81,90.4 | 41.93,90.75 41.93,90.5 41.94,90.5 C1.2 | 3.05,52.38 3.05,52.35 | 23.62,66.5 23.5,66.5 | 23.62,66.5 IC1.19 23.65,66.55 | 23.62,66.5 27.13,66.5 27.69,67.06 27.69,76.02 | 27.69,76.02 27.69,76.18 | 14.68,90.75 14.78,90.65 | 3.91,21.84 3.9,21.84 3.9,21.78 3.91,21.77 3.94,21.79 v3.96,21.79 | 100UF2.- 3.9,20.21 3.91,20.22 4.21,19.92 | IC1.8 34.54,69.09 34.75,69.29 36.2,69.29 36.52,68.96 36.52,68.91 36.53,63.68 | 36.53,63.14 36.52,58.83 v34.95,57.23 | 36.53,63.14 36.53,63.68 | U$1.15 44.17,74.52 46.18,72.52 46.18,64.82 45.03,63.68 36.53,63.68 | 36.52,63.14 36.53,63.17 36.53,63.14 | C1.2 47.6,89.38 v47.6,87.76 47.6,87.78 | 8.38,49.58 4.12,49.58 3.1,50.6 SERIAL.1 | SERIAL.1 3.1,52.48 | DC_IN.2 56.54,73.46 57.61,73.64 57.61,77.22 | 57.61,77.22 RS232PWR.1 | 36.53,63.68 36.52,63.68 | 46.76,90.45 46.71,90.5 C1.2 | 3.05,52.38 3.05,52.04 | SERIAL.1 3.05,52.38 | SERPDR.2 3.05,56.26 3.05,52.38
  Bottom 0.61: 27.69,76.02 27.69,76.45 24.89,79.27 21.59,82.58 ICSP.3 | 23.65,66.55 23.62,66.57 v25.02,66.57 10.29,66.57 8.31,64.59 8.33,64.57 v8.33,64.52 | 57.61,77.22 57.61,83.11 56.69,84.05 50.77,84.05 47.68,87.15 47.68,87.71 47.6,87.78 | 47.6,87.78 47.57,87.81 | C7.2 22.3,90.6 22.28,90.58 22.25,90.6 | 10.44,90.22 C10.2 | 10.95,90.65 10.52,90.22 10.44,90.22 | 4.29,87.81 4.22,87.73 | 4.29,87.81 X1.2 | 4.9,87.88 5.11,87.88 5.11,84.33 8.2,81.23 15.72,81.23 17.02,82.53 19.2,82.53 19.23,82.5 | 4.9,87.88 4.37,87.88 4.29,87.81 | ICSP.3 19.15,82.58 | 19.23,82.5 19.3,82.42 | ICSP.3 19.23,82.5 | 4.9,87.88 4.9,87.78 7.34,90.22 10.44,90.22
  Bottom 1.27: 3.9,21.84 3.9,20.36 3.66,20.12 100UF2.- 3.91,20.14 | ZENER.A 4.21,19.92 | IN/OUT/OW.1 8.38,49.58 9.65,49.58 11.02,50.95 11.02,57.05 v11.35,57.38
N$1
  Top 0.61: X4.10 21.87,4.75 21.39,5.23 SER20.2 15.67,5.13 15.6,5.06 15.49,5.16 12.95,5.16 PUR20/SDI.1
N$2  (via drill 0.6)
  Top 0.61: T1IN.P$2 40.28,69.22 v40.36,69.22
  Bottom 0.61: v40.36,69.22 40.74,69.44 U$1.11
N$3
  Top 0.61: X4.7 21.84,19.99 19.92,21.92 SER17.2 15.67,21.95 12.9,21.95 | 12.9,21.95 12.78,21.95 | PUR17.1 12.9,21.95
N$4  (via drill 0.6)
  Top 0.61: R1OUT.P$2 39.24,70.66 v39.9,70.66
  Bottom 0.61: U$1.12 42.95,70.73 42.95,70.74 39.98,70.74 v39.9,70.66
N$5
  Bottom 0.61: U$1.10 44.47,68.17 44.98,67.67 44.98,65.96 44.3,65.28 T1IN1.P$2
N$6
  Bottom 0.61: 43.36,66.9 U$1.9 T1IN2.P$2
N$7  (via drill 0.6)
  Top 0.61: 39.56,96.25 39.52,96.29 | 39.56,96.25 43.54,92.28 45.39,92.28 47.7,94.59 47.73,94.59 49.2,96.06 50.47,96.06 v50.49,96.09 | v20.22,71.09 20.09,71.15 22.02,71.15 25.38,74.5 25.38,89.33 24.59,90.12 24.59,96.6 25.48,97.48 38.35,97.48 39.57,96.27 39.56,96.25
  Bottom 0.61: v20.22,71.09 20.88,71.63 23.62,71.63 | 23.62,71.63 23.6,71.6 | 23.62,71.63 IC1.23 | SER1.2 56.46,96.98 55.55,96.06 50.49,96.06 v50.49,96.09 50.47,96.06 50.47,95.91 47.88,93.32 46.5,93.32 C1.1
N$8  (via drill 0.6)
  Top 0.61: SER17.1 15.77,18.59 19.1,18.59 20.3,17.4 22.71,17.4 v22.73,17.42 | v38.56,60.6 38.46,60.5 19.76,60.5 18.82,61.44 v18.82,75.26
  Bottom 0.61: v22.73,17.42 22.76,17.45 26.01,17.45 35.69,27.13 35.69,53.87 38.56,56.74 v38.56,60.6 | IC1.26 23.65,75.46 19.03,75.46 v18.82,75.26
N$9  (via drill 0.6)
  Top 0.61: 39.85,98.5 39.67,98.68 | 39.85,98.5 42.77,95.58 v44.91,95.58 | v15.6,69.16 15.49,69.27 15.49,74.3 11.68,78.11 11.68,87.88 15.49,91.69 15.49,95.33 17.04,96.88 19.23,96.88 20.45,95.66 20.45,94.54 21.06,93.93 22.53,93.93 23.29,94.69 23.29,97.59 24.61,98.91 39.5,98.91 39.88,98.53 39.85,98.5
  Bottom 0.61: C2.1 43.15,93.9 43.36,93.9 43.36,94.08 v44.91,95.58 | SER2.2 49.2,97.13 47.65,95.58 v44.91,95.58 | IC1.21 15.54,69.09 15.54,69.16 v15.6,69.16 | v44.91,95.58 43.79,94.54 | v44.91,95.58 44.86,95.58
N$10  (via drill 0.6)
  Top 0.61: v35.89,71.83 35.89,77.06 33.27,79.68 33.27,81.74 31.19,83.82 31.19,89.87 33.04,91.72 37.77,91.72 37.77,91.69 38.91,92.84 38.91,94.77 38.23,95.45 v38.25,95.45
  Bottom 0.61: SER3.2 44.14,97.61 41.83,95.3 38.38,95.3 38.23,95.45 v38.25,95.45 38.3,95.45 38.48,95.28 C3.1 | IC1.6 35.69,71.63 v35.89,71.83
N$11  (via drill 0.6)
  Top 0.61: 15.77,7.39 15.82,7.34 | 15.77,7.39 SER19.1 17.04,7.39 17.58,6.86 v17.58,6.81 | 15.77,7.39 15.75,7.42
  Bottom 0.61: IC1.16 15.34,62.74 14.3,61.7 14.3,57.23 14.81,56.72 14.81,25.45 17.35,22.91 17.35,7.01 17.55,6.81 v17.58,6.81
N$12  (via drill 0.6)
  Top 0.61: v18.67,95.3 18.67,90.96 19.99,89.64 22.02,89.64 23.95,87.68 v23.95,85.27
  Bottom 0.61: C8.1 v18.67,95.3 18.67,97.99 18.7,97.99 SER8.1 | 33.79,76.65 33.76,76.61 32.66,76.61 23.95,85.32 v23.95,85.27 23.88,85.5 | 33.79,76.65 33.91,76.76 | 33.79,76.65 33.78,76.66 33.83,76.71 IC1.2
N$13  (via drill 0.6)
  Top 0.61: 28.09,40.82 27.33,40.82 25.4,42.75 25.4,45.64 23.62,47.4 18.24,47.4 | 28.09,40.82 29.87,40.82 | 29.87,40.82 29.9,40.82 29.9,40.79 | 15.98,49.61 15.97,49.6 SER12.1 15.87,49.45 16.13,49.45 18.24,47.35 18.24,47.4 | 18.24,47.4 18.19,47.4 | 28.09,40.82 28.09,40.79 28.04,40.84 27.94,40.84 | 29.87,40.82 29.9,40.79 | 29.85,40.97 29.85,40.84 29.9,40.79 | 29.85,40.97 v29.85,41.68 | TR-A12.1 33.43,33.86 31.37,35.92 31.37,40.72 31.14,40.94 | 31.14,40.94 31.12,40.97 29.85,40.97 | 31.14,40.94 PDR12.1
  Bottom 0.61: IC1.13 33.2,62.74 29.87,59.41 29.87,41.71 v29.85,41.68
N$14  (via drill 0.6)
  Top 0.61: 13,40.69 13.03,40.67 | 13,40.69 SER13.1 15.87,40.87 15.85,40.89 15.93,40.97 17.76,40.97 20.88,37.85 24.11,37.85 25.83,36.12 25.83,34.54 27.28,33.1 27.33,33.1 27.36,33.07 27.34,33.06 29.08,31.32 29.44,31.32 | 13,40.69 12.93,40.77 | v29.39,32.82 29.44,32.77 29.44,31.32 | TR-A13.1 32.99,24.08 31.75,25.32 31.75,30.89 31.32,31.32 PDR13.1 31.3,31.34 31.29,31.34 31.27,31.32 29.44,31.32
  Bottom 0.61: IC1.12 32.77,64.01 28.52,59.77 28.52,33.6 29.31,32.82 v29.39,32.82
N$15  (via drill 0.6)
  Top 0.61: 15.87,35.26 15.87,35.25 SER14.1 15.8,35.23 | 26.24,29.9 26.24,24.46 30.25,20.45 PDR14.1 | 15.8,35.23 15.7,35.23 | 15.8,35.23 18.06,35.23 20.09,33.2 23.98,33.2 26.24,30.94 26.24,29.9 | v27.25,29.82 27.18,29.9 26.24,29.9 | TR-A14.1 33.5,13.41 31.67,15.24 31.67,20.07 PDR14.1 | PDR14.1 31.14,20.6 | PDR14.1 | PDR14.1 31.34,20.5 | PDR14.1
  Bottom 0.61: IC1.11 32.38,65.28 27.25,60.15 v27.25,29.82
N$16
  Top 0.61: 42.06,42.57 PUOR12.1 | LED12.- 44.32,42.65 44.3,42.62 | 53.19,43.48 53.21,43.46 OUTPUT1.4
  Top 1.27: POLYFUSE12.2 40.79,41.3 42.06,42.57 | PUOR12.1 44.3,42.62 | LED12.- 44.25,41.3 45.01,40.54 50.24,40.54 53.19,43.48
  Bottom 0.61: OUTPUT1.4 53.24,43.59 53.07,43.41 FBD12.2
N$17
  Top 0.61: 38.76,4.34 38.76,4.24 POLYFUSE15.1 | TR-A15.2 35.33,4.34
  Top 1.27: 35.33,4.34 38.76,4.34
N$18
  Top 0.61: 41.45,11.99 41.45,12.04 | 41.45,11.99 PUOR15.1 | 41.45,11.91 41.45,11.99 | 43.71,11.86 43.97,12.12 44.02,12.06 LED15.- 43.99,11.81 43.87,11.94 43.81,11.89 43.81,10.97
  Top 1.27: POLYFUSE15.2 41.45,11.91 | PUOR15.1 43.71,11.86 | OUTPUT1.10 52.73,12.98 48.44,8.69 46.1,8.69 43.81,10.97
  Bottom 0.61: 53.39,12.98 53.42,12.95 | OUTPUT1.10 53.39,12.98 | FBD15.2 46.74,14.68 51.69,14.68 53.39,12.98
N$19  (via drill 0.6)
  Top 0.61: v50.19,67.64 49.05,67.64 47.7,68.99 47.7,80.47 47.24,81.1 RS232.1
  Bottom 0.61: U$1.7 49.66,68.17 v50.19,67.64
N$20
  Top 0.61: X4.6 21.92,25.04 21.89,25.07 20.7,25.07 18.24,27.53 SER16.2 15.67,27.58 PUR16.1
N$21
  Top 0.61: 38.4,15.62 POLYFUSE14.1 | TR-A14.2 35.36,15.62
  Top 1.27: 35.36,15.62 38.4,15.62
N$22
  Top 0.61: PUOR14.1 41.4,22.99 40.59,22.99 | 44.4,23.11 44.38,23.09 44.37,23.09 LED14.- 44.17,22.45 | 53.29,23.04 53.24,23.09 OUTPUT1.8
  Top 1.27: POLYFUSE14.2 40.59,22.99 | PUOR14.1 44.38,23.09 | 44.17,22.45 46.05,20.57 51.59,20.57 52.02,21.01 52.02,21.77 53.29,23.04
  Bottom 0.61: OUTPUT1.8 53.24,23.09 53.26,23.06 53.22,23.02 FBD14.2
N$23
  Top 0.61: TR-A13.2 35.13,26.31 35.08,26.26 35.1,26.24
  Top 1.27: 35.1,26.24 POLYFUSE13.1
N$24
  Top 0.61: 43.99,33.25 44.09,33.15 | 43.99,33.25 LED13.- | 43.84,33.4 43.99,33.25 | 38.4,31.32 38.53,31.19 | 40.74,33.4 PUOR13.1 | 53.47,33.32 53.44,33.3 OUTPUT1.6
  Top 1.27: PUOR13.1 43.84,33.4 | POLYFUSE13.2 38.4,31.32 | 38.53,31.19 40.74,33.4 | 44.09,33.15 44.09,32.13 45.31,30.91 51.05,30.91 53.44,33.3
  Bottom 0.61: OUTPUT1.6 53.19,33.35 52.97,33.13 FBD13.2
N$25
  Top 0.61: X4.4 20.98,35.23 17.6,38.61 SER14.2 15.65,38.61 15.6,38.66 PUR14.2
N$26
  Top 0.61: X4.2 21.89,45.39 22.05,45.49 17.83,45.49 17.12,46.2 SER12.2 15.57,46.2 15.55,46.18 PUR12.2
N$27
  Top 0.61: POLYFUSE12.1 38.38,36.2 37.59,36.17 37.85,36.2
  Top 1.27: TR-A12.2 37.85,36.2
N$28
  Top 0.61: 22.02,40.23 X4.3 18.16,44.09 SER13.2 15.72,44.09 15.69,44.07 PUR13.2
N$29
  Top 0.61: TR-A11.2 34.87,45.77 35.08,45.97
  Top 1.27: POLYFUSE11.1 38,45.03 37.06,45.97 35.08,45.97
N$30
  Top 0.61: 41.5,52.4 41.53,52.38 PUOR11.1 | 43.38,52.38 LED11.- 43.74,52.63 | 53.47,53.57 53.42,53.62 OUTPUT1.2
  Top 1.27: POLYFUSE11.2 39.22,50.11 41.5,52.4 | PUOR11.1 43.38,52.38 | 43.74,52.63 46.05,50.37 50.32,50.39 53.47,53.57
  Bottom 0.61: 53.26,53.59 OUTPUT1.2 53.1,53.75 FBD11.2
N$31
  Bottom 0.61: 23.77,77.88 IC1.28 21.62,80.04 ICSP.4 19,80.04
N$32
  Top 0.61: 21.95,30.05 22.07,29.92 | 21.95,30.05 X4.5 | 21.95,30.05 21.74,30.25 20.75,30.25 17.98,33.02 SER15.2 15.75,33.02 15.65,33.12 PUR15.1
N$33  (via drill 0.6)
  Top 0.61: 15.97,29.72 16,29.69 15.93,29.62 SER15.1 18.31,29.59 v20.3,27.61 20.14,27.66 24.03,27.66 25.1,26.59 25.1,10.49 26.49,9.09 PDR15.1 | PDR15.1 30.79,9.09 | PDR15.1 31.01,8.69 31.01,4.14 32.97,2.18 35.18,2.18 TR-A15.1
  Bottom 0.61: 20.47,27.66 v20.3,27.61 20.3,27.74 | IC1.7 33.98,70.36 34.01,70.33 32.89,70.33 32.79,70.23 32.77,70.23 31.12,68.58 31.12,65.61 25.4,59.87 25.4,28.55 24.51,27.66 20.47,27.66 | 20.47,27.66 20.3,27.66 20.3,27.74 | 20.3,27.74 20.27,27.64
N$35  (via drill 0.6)
  Top 0.61: Q21.2 31.09,68.15 32.77,66.52 35.1,66.52 v35.18,66.6
  Bottom 0.61: IC1.10 33.98,66.52 34.06,66.6 v35.18,66.6
N$36  (via drill 0.6)
  Top 0.61: 3.2,41.17 3.28,41.25 3.38,41.15 TR-A111.1 3.48,41.02 3.3,40.84 v1.52,40.84
  Bottom 0.61: v1.52,40.84 0.81,41.55 0.81,62.23 0.81,62.2 0.81,62.79 1.73,63.7 2.92,63.7 | 2.82,59.97 2.74,59.97 SERPDR.1 2.69,60.12 2.92,60.12 2.92,63.7 | 2.92,63.7 2.92,63.73 4.62,63.73 SERIAL_INVERT.P$2
N$37
  Top 0.61: ICSP.1 19.28,87.71 15.87,87.71 ISCPRES.1
  Bottom 0.61: 34.11,83.72 RESET.2 | 19.2,87.68 19.15,87.68 | ICSP.1 19.2,87.68 | 34.11,83.72 30.15,87.68 19.2,87.68 | IC1.1 33.96,83.57 34.11,83.72
N$38
  Top 0.61: SERIAL.2 5.64,50.62 6.33,49.94 8.03,49.94 8.66,49.3 8.66,45.39 9.09,44.96 9.09,44.88 9.52,44.45 9.52,39.5 8.46,38.43 5.89,38.43 5.72,38.61 SERPUR.2 5.69,38.68 5.61,38.76 5.79,38.94 TR-A111.2
  Bottom 0.61: 5.77,53.34 5.77,52.4 5.74,52.43 SERIAL.2 5.64,52.45 5.59,52.5 5.71,52.63 SERSER.P$2
N$39  (via drill 0.6)
  Top 0.61: 35.31,67.89 v35.28,68.1 35.36,67.87 35.28,67.87 33.78,69.37 33.78,73.53 30.94,76.38 30.94,79.07 30.91,79.1 30.86,79.05 Q21.1
  Bottom 0.61: IC1.9 33.96,67.87 33.93,67.89 33.96,67.92 33.91,67.89 35.08,67.89 v35.28,68.1
N$40
  Bottom 0.61: 23.72,76.71 23.75,76.73 | 23.72,76.71 IC1.27 20.12,76.71 19.23,77.6 | 23.72,76.71 23.7,76.68 | 19.23,77.6 19.18,77.65 | ICSP.5 19.23,77.6
N$41  (via drill 0.6)
  Top 0.61: v26.87,65.08 38.1,65.08 38.71,65.68 R1OUT.P$1 38.68,67.62 | 9.75,95.1 v9.78,95.1 9.78,92.3 7.44,89.97 7.44,76.45 10.57,73.33 10.57,66.19 11.18,65.58 11.18,65.3 v11.2,65.28
  Bottom 0.61: 8.03,97.97 8.31,98.25 8.56,97.99 SER10.2 8.56,96.22 9.68,95.1 v9.78,95.1 | 11.2,65.3 v11.2,65.28 IC1.18 26.77,65.28 v26.87,65.08
N$42
  Bottom 0.61: 13.59,101.17 13.59,101.12 | 13.59,101.17 SER9.1 13.66,101.19 13.66,100.08 13.11,99.52 11.76,99.52 11.23,98.98 PUR9.2 11.23,96.14 13.87,93.5 C9.1 | X3.9 13.59,106.3 13.59,101.17
N$43  (via drill 0.6)
  Top 0.61: v31.62,95 30.02,95 28.96,93.88 28.96,75.44 v29.34,75.06
  Bottom 0.61: T1IN1.P$1 38.33,65.28 37.59,66.02 37.59,73.64 36.93,74.3 33.6,74.3 33.55,74.24 33.65,74.14 33.91,74.14 | C5.1 30.76,93.3 31.42,93.6 31.62,93.62 v31.62,95 33.93,97.31 33.93,98.1 | IC1.4 33.93,74.14 33.91,74.14 | 33.91,74.14 33.91,74.12 30.3,74.12 29.36,75.06 v29.34,75.06 | 33.93,98.1 33.93,98.17 | 33.93,98.1 SER5.2
N$44  (via drill 0.6)
  Top 0.61: v14.02,63.98 13.87,63.98 13.89,64.01 13.92,73.94 10.36,77.5 10.36,88.52 14.15,92.3 14.15,92.73 14.1,92.73 | v26.44,63.55 39.75,63.55 40.28,64.08 T1IN.P$1 40.28,65.13 | 14.1,92.73 14.1,92.51 | 14.1,92.73 v14.1,95.91
  Bottom 0.61: 13.92,64.01 IC1.17 25.98,64.01 v26.44,63.55 | v14.02,63.98 13.92,63.98 13.89,64.01 13.92,64.01 | 13.92,64.01 12.83,62.92 12.85,62.92 8.71,58.78 C6SERIAL.P$1 | 13.61,97.77 13.61,97.61 | 13.92,96.09 v14.1,95.91 14.1,95.94 13.61,96.42 13.61,97.61 | 13.61,97.61 13.54,97.61 13.64,97.71 SER9.2
N$45  (via drill 0.6)
  Top 0.61: v47.83,65.86 46.61,65.86 46.23,66.24 46.23,77.65 44.63,79.43 44.63,81.15 44.78,81.2 | 44.78,81.2 44.53,81.08 | 44.78,81.2 RS232.2
  Bottom 0.61: U$1.8 47.83,66.88 v47.83,65.86
N$49
  Bottom 0.61: 43.18,73.25 U$1.14 41.58,73.25 40.89,73.94 40.89,78.69 42.11,79.91 42.11,81.23 RS232.3 42.19,81.18
N$52
  Top 0.61: LEDR15.2 44.17,15.47 44.09,15.54 43.81,15.26 PUOR15.2 | OUTPUT1.9 53.24,17.98 53.26,17.96 53.21,17.91 45.87,17.91 | 44.4,26.47 44.47,26.39 | 44.4,26.47 LEDR14.2 44.27,26.77 | PUOR14.2 44.38,26.49 44.4,26.47 | OUTPUT1.7 53.42,28.22 53.44,28.25 53.09,28.6 46.1,28.6 | 54.25,58.7 OUTPUT1.1 53.26,58.7 53.44,58.88 53.19,59.13 45.59,59.13 43.82,57.35 LEDR11.2 43.84,55.65 | 56.92,48.51 56.16,48.51 56.13,48.54 | 56.9,38.4 56.16,38.38 | LEDR13.2 43.84,36.78 43.76,36.7 43.66,36.8 PUOR13.2 | OUTPUT1.5 53.67,38.38 53.7,38.4 53.39,38.71 | 56.95,28.68 56.16,28.68 56.08,28.6 | PUOR12.2 43.86,46.02 44.09,46.25 LEDR12.2 44.25,46.13 | 53.42,48.54 53.47,48.49 | OUTPUT1.3 53.42,48.54 | 53.42,48.54 53.06,48.44 | 43.84,55.65 44.04,55.45 | PUOR11.2 43.71,55.78 43.84,55.65 | SOURCE.2 52.43,64.34 52.48,64.52 52.27,64.49
  Top 1.27: LEDR15.2 44.17,16.21 45.87,17.91 54.66,17.91 56.92,20.22 56.95,28.68 56.9,38.4 56.92,48.51 56.95,56.01 54.25,58.7 | 44.27,26.77 46.1,28.6 56.08,28.6 | OUTPUT1.1 53.06,58.7 | 56.13,48.54 OUTPUT1.3 | 56.16,38.38 OUTPUT1.5 | LEDR13.2 44.04,37.85 44.91,38.71 53.39,38.71 | 44.25,46.13 46.91,48.44 53.06,48.44 | 53.19,59.13 52.91,58.57 52.48,59 52.48,64.52
  Bottom 0.61: 53.39,18.06 53.52,17.93 | 53.39,18.06 OUTPUT1.9 | 53.39,18.06 53.32,18.13 FBD14.1 46.88,18.09 | 53.36,28.24 53.34,28.22 OUTPUT1.7 | 53.36,28.24 FBD13.1 | 53.36,28.24 53.49,28.37 | OUTPUT1.5 53.24,38.43 53.26,38.46 53.19,38.52 FBD12.1 | 53.42,48.54 53.47,48.49 | OUTPUT1.3 53.42,48.54 | FBD11.1 53.09,48.86 53.42,48.54 | FBD15.1 46.99,9.68 45.64,9.68 44.14,11.17 44.14,15.95 46.28,18.09 46.88,18.09 | 46.88,18.09 46.99,18.09
N$55
  Top 0.61: LEDRESMAIN.1 8.44,10.49 8.43,10.49 8.36,10.41 LED200.-
N$60
  Bottom 0.61: U$1.13 41.15,71.98 39.78,73.36 39.78,81.13 39.6,81.31 | 39.52,81.33 39.57,81.43 RS232.4 39.6,81.31 | 39.6,81.31 39.57,81.33
N$63
  Top 0.61: 6.27,24.21 VR2.1 | 8.43,28.04 8.46,28.02 VR1.1 | 8.56,27.92 8.56,26.49 | 8.84,20.32 8.81,20.35 CMAIN.1
  Top 1.27: 8.56,26.49 6.27,24.21 | 8.46,28.02 8.56,27.92 | VR2.1 6.27,22.89 8.81,20.35
  Bottom 0.61: 57.53,66.83 57.43,66.83 POLYFUSE200.2 57,66.93 | 8.48,27.84 VR1.1
  Bottom 1.27: 57,66.93 57,62.1 55.93,61.06 50.09,61.06 49.58,60.55 43.69,60.55 41.4,58.27 41.4,3.76 39.32,1.68 14.53,1.68 12.6,3.61 12.6,17.14 14.02,18.62 14.02,21.77 8.48,27.3 8.48,27.84
N$71
  Top 0.61: LED15.+ 48.18,11.81 48.21,11.84 47.57,12.47 LEDR15.1
N$72
  Top 0.61: LED14.+ 48.36,23.09 48.39,23.11 47.67,23.83 LEDR14.1
N$73
  Top 0.61: 48.11,33.3 48.13,33.27 | LED13.+ 48.11,33.3 | LEDR13.1 47.45,33.96 48.11,33.3
N$74
  Top 0.61: LED12.+ 48.44,42.72 48.46,42.75 47.65,43.56 LEDR12.1
N$75
  Top 0.61: LEDR11.1 47.22,55.29 47.19,55.27 47.75,54.71 LED11.+
N$77
  Bottom 0.61: 44.09,106.55 44.09,106.43 X3.3 44.12,106.38 | PUR3.2 41.68,99.06 42.27,99.64 43.54,99.64 44.04,100.15 44.04,101.12 44.2,101.27 44.14,101.32 SER3.1 44.14,106.35 44.12,106.38 | 43.99,106.5 44.12,106.38
N$80
  Bottom 0.61: U$1.5 48.46,70.71 48.51,70.66 48.56,70.71 RC2.2
N$81
  Bottom 0.61: U$1.3 49.4,73.25 50.01,73.86 50.01,74.27 51.84,76.1 51.94,76 RC1.2
N$82
  Bottom 0.61: RC2.1 52.24,73.51 51.61,73.56 50.04,71.98 U$1.4
N$83
  Bottom 0.61: U$1.1 48.34,75.79 51.29,78.74 RC1.1
N$84
  Top 0.61: RC4.1 52.52,81.07 53.7,82.25 54.1,82.09 54.69,82.35 RS232PWR.3
  Bottom 0.61: U$1.2 46.51,74.52 45.74,75.29 45.74,76.28 51.82,82.35 55.07,82.35 RS232PWR.3 54.69,82.37
N$85  (via drill 0.6)
  Top 0.61: v49.81,69.44 50.75,69.44 52.09,70.79 RC5.2 50.7,70.79 49.4,72.09 49.4,74.47 | 49.4,74.47 49.4,74.6 | RS232PWR.2 54.69,79.78 53.7,79.7 49.43,75.44 49.43,74.5 49.4,74.47
  Bottom 0.61: U$1.6 v49.81,69.44
N$86
  Bottom 0.61: 38.99,106.35 39.04,106.35 X3.4 39.06,106.4 | PUR4.2 36.52,99.19 37.11,99.77 38.46,99.77 38.96,100.28 38.96,101.24 39.06,101.35 SER4.1 39.06,106.4 | 39.06,106.4 39.09,106.43
N$87
  Bottom 0.61: 33.96,106.4 33.96,106.63 | 33.96,106.4 X3.5 | 33.96,106.4 33.96,101.47 SER5.1 34.01,101.45 34.04,101.42 34.04,100.33 33.45,99.75 32,99.75 31.47,99.21 PUR5.2
N$88
  Bottom 0.61: 18.69,106.43 18.69,106.63 | 18.69,106.43 X3.8 | 18.69,106.43 18.69,101.4 SER8.2 18.75,100.1 18.24,99.59 16.74,99.59 16.15,99.01 16.15,98.12 16.26,98.02 16.21,97.97 PUR8.2
N$89
  Bottom 0.61: 54.33,106.4 54.33,106.5 | 54.33,106.4 X3.1 54.3,106.43 | 54.33,106.4 54.53,106.2 | 56.46,101.35 56.52,101.4 | 56.46,101.35 SER1.1 56.44,101.32 56.44,104.29 54.3,106.43 | PUR1.2 56.46,101.34 56.46,101.35 | 54.3,106.43 54.25,106.48
N$90  (via drill 0.6)
  Top 0.61: 13.21,51.64 13.26,51.59 13.29,51.61 15.75,51.61 SER11.1 15.87,51.59 15.87,51.46 16.97,51.46 19.79,48.64 24.87,48.64 27.48,51.26 28.98,51.26 | 30.8,51.04 31.04,50.8 31.04,45.24 32.82,43.46 32.82,43.48 | 30.8,51.04 30.71,51.13 | 28.98,51.26 29.01,51.26 | 28.98,51.26 28.98,51.28 29.01,51.26 | 32.82,43.48 | 32.82,43.48 v32.82,43.51 32.87,43.51 32.92,43.46 TR-A11.1 | 29.01,51.26 PDR11.1 30.76,51.26 30.89,51.13 30.8,51.04
  Bottom 0.61: IC1.14 33.68,61.47 33.68,44.37 v32.82,43.51
N$91
  Bottom 0.61: 49.28,106.55 49.28,106.43 X3.2 49.22,106.48 49.2,106.5 SER2.1 49.2,101.32 49.02,101.14 49.02,100.1 48.59,99.67 47.35,99.67 46.74,99.06 PUR2.2
N$92
  Top 0.61: X4.1 22.05,50.47 22.07,50.49 17.55,55.02 SER11.2 13.33,55.02 13.23,54.91 PUR11.2
N$95  (via drill 0.6)
  Top 0.61: v29.57,72.8 27.81,74.55 27.81,94.64 29.34,96.19 32.92,96.19 35.43,96.16 v36.07,95.5
  Bottom 0.61: SER4.2 36.57,95.5 v36.07,95.5 36.02,95.5 34.42,93.9 C4.1 | v29.57,72.8 29.64,72.87 33.65,72.87 | 33.65,72.87 33.98,72.87 | 33.65,72.87 33.65,72.9 IC1.5
N$99  (via drill 0.6)
  Top 0.61: v17.02,74.17 16.97,74.27 16.97,61.32 v17.91,60.38 17.96,60.32 | SER16.1 15.67,24.18 | SER16.1 15.75,24.16 | SER16.1 15.85,24 17.3,24 17.91,24.61 v17.91,26.16
  Bottom 0.61: IC1.25 v17.02,74.17 17.98,74.17 18.03,74.22 14.71,74.22 | v17.91,60.38 17.93,60.43 18.36,59.99 18.36,26.19 18.29,26.16 18.26,26.16 | 18.26,26.16 18.24,26.19 | v17.91,26.16 18.26,26.16 | 14.71,74.22 14.66,74.22 | B4SERIAL.P$2 6.99,65.53 10.54,69.09 10.54,71.93 12.83,74.22 14.71,74.22
N$100
  Top 0.61: X4.9 21.92,9.83 21.82,9.73 20.75,10.79 SER19.2 15.7,10.62 15.6,10.52 15.39,10.72 12.95,10.72 12.95,10.77 PUR19/SDO.1
N$102
  Top 0.61: 21.95,14.83 X4.8 22,14.86 | PUR18.1 12.85,16.43 12.85,16.36 15.44,16.36 15.6,16.21 15.67,16.28 SER18.2 17.19,14.86 22,14.86 | 22,14.86 22.02,14.86
N$104
  Bottom 0.61: B4SERIAL.P$1 6.93,60.96 5.71,60.96 | 5.71,60.96 SERIAL_INVERT.P$1 | SERSER.P$1 5.71,60.93 | 5.71,60.93 5.71,60.96 | C6SERIAL.P$2 5.71,58.78 5.71,60.93
N$106
  Bottom 0.61: 28.96,106.43 28.98,106.43 28.98,106.05 | 28.98,106.05 28.98,101.47 SER6.1 28.85,101.34 28.85,99.9 28.68,99.72 27.03,99.72 26.42,99.11 26.42,98.02 PUR6.2 | 26.26,98.15 26.26,98.07 PUR6.2 | PUR6.2 25.78,97.39 25.78,96.88 25.02,96.11 25.02,94.72 26.14,93.6 26.54,93.6 26.54,93.48 C6.1 | 28.98,106.05 28.91,106.05 X3.6
N$107  (via drill 0.6)
  Top 0.61: v26.37,72.47 26.52,72.62 26.52,95.48 v26.49,95.5
  Bottom 0.61: SER6.2 28.5,97.59 28.5,95.78 28.22,95.5 v26.49,95.5 | v26.37,72.47 26.37,71.3 25.38,70.31 23.65,70.31 23.65,70.33 IC1.22 23.65,70.36 23.7,70.31
N$108
  Bottom 0.61: 24,106.2 24,106.1 | 24,106.2 X3.7 | 24,106.2 24,106.86 23.88,106.98 23.88,101.34 SER7.2 23.93,101.29 24,101.22 23.8,101.02 23.8,99.8 23.6,99.59 21.84,99.59 21.23,98.98 PUR7.2 21.23,97.21 20.22,96.19 20.22,95.1 21.77,93.55 22.2,93.55 C7.1
N$109
  Bottom 0.61: SER10.1 8.56,101.04 | X3.10 8.56,106.35 SER10.1 | SER10.1 8.56,101.09 8.61,101.04 8.43,100.86 8.43,100.03 7.95,99.54 6.22,99.54 5.87,99.19 PUR10.2 5.87,95.23 7.82,93.27 10.18,93.27 10.33,93.12 C10.1
N$111  (via drill 0.6)
  Top 0.61: v12.42,70.89 12.45,70.84 12.45,73.2 | 12.45,73.2 12.45,73.43 | v21.87,95.63 21.84,95.66 21.84,96.8 20.02,98.63 14.1,98.63 12.62,96.7 12.62,92.69 9.02,89.08 9.02,77.01 12.45,73.58 12.45,73.2
  Bottom 0.61: IC1.24 20.04,72.9 18.21,71.07 12.57,71.07 12.39,70.89 | 12.39,70.89 12.37,70.87 | v12.42,70.89 12.39,70.89 | SER7.1 23.52,97.59 23.52,96.7 22.48,95.66 21.87,95.66 v21.87,95.63
SER18  (via drill 0.6)
  Top 0.61: SER18.1 15.44,12.98 15.31,13.11 15.7,13.49 15.7,13.61 14.73,14.58 14.35,14.58 | v12.24,59.16 43,59.16 44.98,61.14 44.98,76.53 42.57,78.94 v37.77,78.94 37.69,78.94 | 14.35,14.58 14.33,14.58 | v14.38,14.6 14.35,14.58
  Bottom 0.61: 12.9,30.56 6.43,30.56 5.82,31.17 5.82,33.45 IN/OUT/OW.2 | v14.38,14.6 15.14,14.6 15.7,15.19 15.7,22.63 12.93,25.4 12.9,30.56 | 37.74,78.82 37.69,78.87 37.74,78.92 | IC1.3 37.67,75.44 37.67,75.46 | v37.77,78.94 37.74,78.92 | 37.67,75.46 37.67,78.84 37.74,78.92 | 37.67,75.46 38.71,74.42 38.71,67.56 39.37,66.9 T1IN2.P$1 | v12.24,59.16 12.17,59.16 12.17,59.21 12.9,59.21 12.9,30.56

### Text on the board
tPlace: 10 | 1 | 1 | General I/O Mini REV2 August 2013 Dan Jubenville | R1 | T1 | T2 | R2 | - | + | 1 | + | - | 1 | + | - | 10 | 10
bPlace: 10 | R1 | T1 | T2 | R2 | - | + | General I/O Mini REV2 August 2013 Dan Jubenville | 5V | 18V | 1 | - | + | 1 | + | - | 10 | 10
tNames: 5V | GND
bNames: 1 | SERINV | B4 SER | C6 SER | SERSER | To invert serial use | fet, SERINV pad, | SERPUR and SERPDR | non-inv use SERSER